# Altium schematic sheet Photodiode.SchDoc
size 420 x 297 mm; Address1: Address1; Address2: Address2; Address3: Address3; Address4: Address4; DocumentNumber: *Э3; SheetNumber: 11; SheetTotal: 12; DocumentType: Схема электрическая *
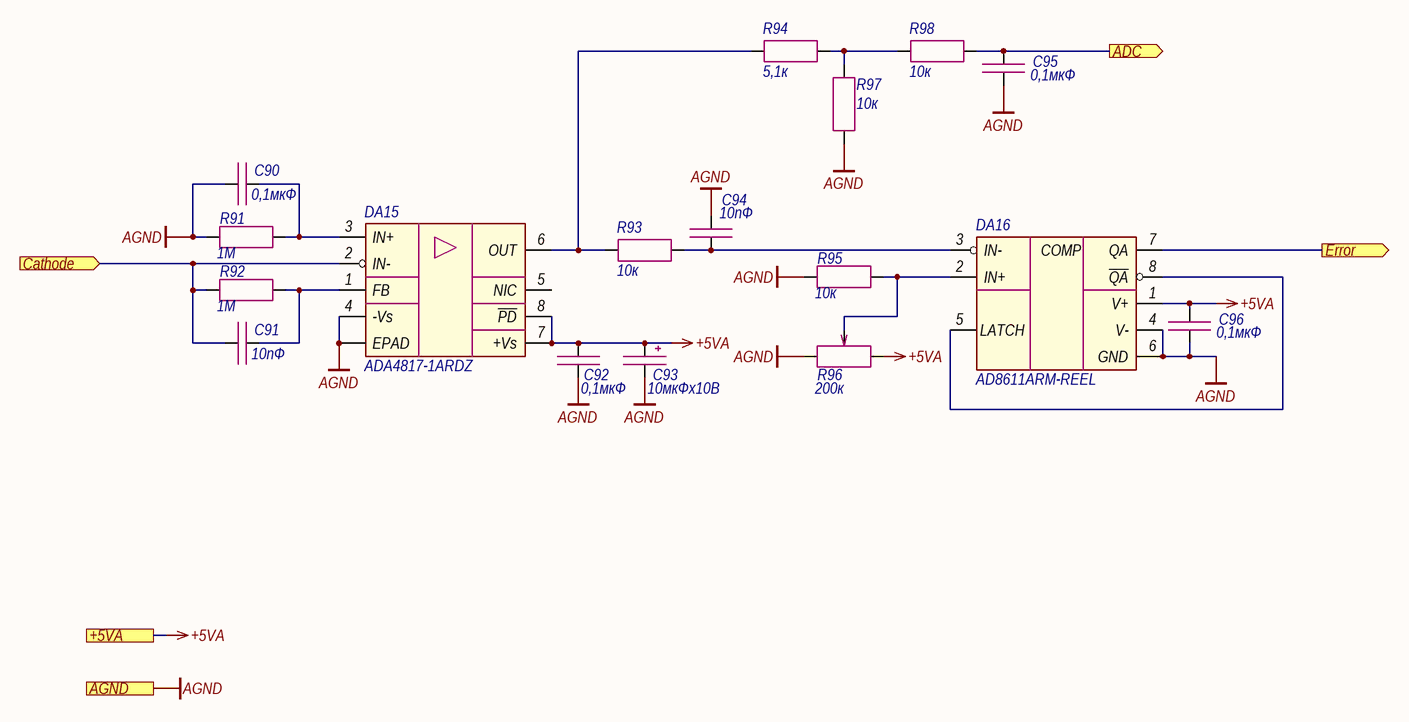
[diagram p0: Photodiode.SchDoc]

## Parts
C90  0,1мкФ  [CAP_0603]
C91  10пФ  [CAP_0603]
C92  0,1мкФ  [CAP_0603]
C93  10мкФх10B  [CAP_A]
C94  10пФ  [CAP_0603]
C95  0,1мкФ  [CAP_0603]
C96  0,1мкФ  [CAP_0603]
DA15  ADA4817-1ARDZ  [SOIC-8 EPAD]
DA16  AD8611ARM-REEL  [MSOP-8]
R91  1М  [RES_0805]
R92  1М  [RES_0805]
R93  10к  [RES_0603]
R94  5,1к  [RES_0603]
R95  10к  [RES_0603]
R96  200к  [3224W]
R97  10к  [RES_0603]
R98  10к  [RES_0603]

## Ports
+5VA (see Main[2C]), ADC (out, see Main[3C]), AGND (see Main[2C], Hardwiring[4D], Thermistor[2C]), Cathode (in, see Main[2C]), Error (out, see Main[3C])

## Nets
+5VA: C92.1 C93.1 C96.1 DA15.7(+Vs) DA15.8(~{PD}) DA16.1(V+) R96.3 ; port +5VA
AGND: C90.1 C92.2 C93.2 C94.2 C95.2 C96.2 DA15.4(-Vs) DA15.EPAD DA16.4(V-) DA16.6(GND) R91.2 R95.1 R96.1 R97.2 ; port AGND
ADC: C95.1 R98.2 ; port ADC
Cathode: C91.2 DA15.2(IN-) R92.2 ; port Cathode
Error: DA16.7(QA) ; port Error
NetC90_2: C90.2 DA15.3(IN+) R91.1
NetC91_1: C91.1 DA15.1(FB) R92.1
NetC94_1: C94.1 DA16.3(IN-) R93.2
NetDA15_6: DA15.6(OUT) R93.1 R94.1
NetDA16_2: DA16.2(IN+) R95.2 R96.2
NetDA16_5: DA16.5(LATCH) DA16.8(~{QA})
NetR94_2: R94.2 R97.1 R98.1

Not connected (* = marked no-connect by the designer): DA15 5(NIC)

## Notes on the sheet
- Подп. и дата
- Инв. № дубл.
- Взам. инв. №
- Инв. № подл.
- Изм.
- Лист
- № докум.
- Подп.
- Дата
- Копировал
- Формат А3
- (in symbol AD8611) COMP

## Library data of the parts
C90 C92 C95 C96 = Capacitor: Manufacturer: Murata; Model: GRM188R71H104KA93D; Value: 0,1мкФ; Document: *
C91 C94 = Capacitor: Manufacturer: Murata; Model: GRM1885C1H100JA01D; Value: 10пФ; Document: *
C93 = Capacitor_Polar: Model: TECAP, 10 мкФ, 10 В, тип A, 10%; Value: 10мкФх10B; Document: *; Manufacturer: *
DA15 = ADA4817-1ARDZ: Manufacturer: Analog Devices; Model: ADA4817-1ARDZ; Document: *
DA16 = AD8611: Manufacturer: Analog Devices; Model: AD8611ARM-REEL; Document: *
R91 R92 = Resistor: Manufacturer: Yageo; Model: RC0805FR-071ML; Value: 1М; Document: *
R93 R95 R97 R98 = Resistor: Manufacturer: Yageo; Model: RC0603FR-0710KL; Value: 10к; Document: *
R94 = Resistor: Manufacturer: Yageo; Model: RC0603FR-075K1L; Value: 5,1к; Document: *
R96 = Resistor_Variable: Manufacturer: Bourns; Model: 3224W-1-204E; Value: 200к; Document: *